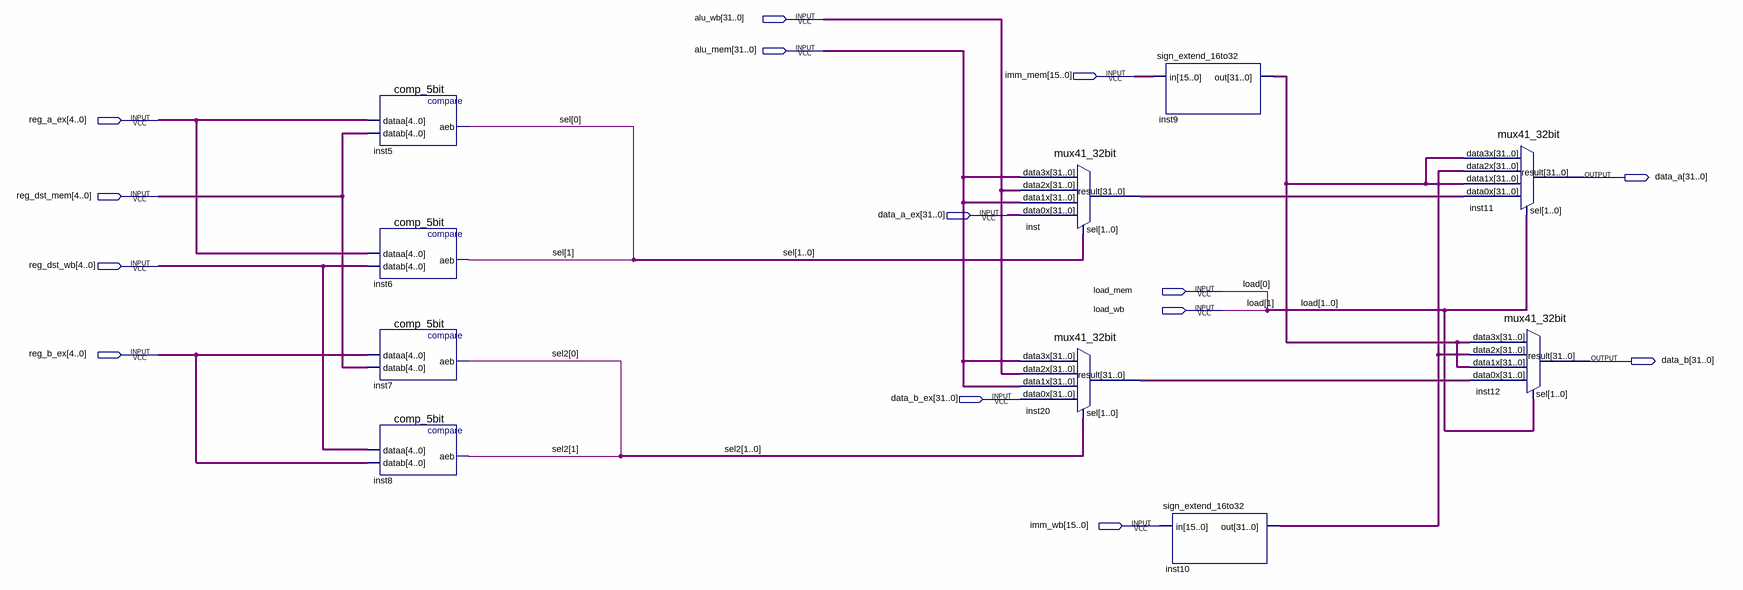
[diagram p0: schematic sheet]
// Quartus schematic reg_selector.bdf as structural Verilog: 10 symbols, 14 pins
module reg_selector (
  input  [31:0] alu_wb,
  input  [31:0] alu_mem,
  input  [15:0] imm_mem,
  input  [4:0] reg_a_ex,
  input  [4:0] reg_dst_mem,
  input  [31:0] data_a_ex,
  input  [4:0] reg_dst_wb,
  input  load_mem,
  input  load_wb,
  input  [4:0] reg_b_ex,
  input  [31:0] data_b_ex,
  input  [15:0] imm_wb,
  output [31:0] data_a,
  output [31:0] data_b
);

  wire [1:0] sel, sel2;
  wire [31:0] inst9_out, inst10_out, inst20_result, inst_result;

  comp_5bit inst5 (.dataa(reg_a_ex), .datab(reg_dst_mem), .aeb(sel[0]));
  comp_5bit inst6 (.dataa(reg_a_ex), .datab(reg_dst_wb), .aeb(sel[1]));
  comp_5bit inst7 (.dataa(reg_b_ex), .datab(reg_dst_mem), .aeb(sel2[0]));
  comp_5bit inst8 (.dataa(reg_dst_wb), .datab(reg_b_ex), .aeb(sel2[1]));
  mux41_32bit inst (
    .data3x(alu_mem), .data2x(alu_wb), .data1x(alu_mem), .data0x(data_a_ex), .sel(sel), .result(inst_result));
  mux41_32bit inst20 (
    .data3x(alu_mem), .data2x(alu_wb), .data1x(alu_mem), .data0x(data_b_ex), .sel(sel2),
    .result(inst20_result));
  sign_extend_16to32 inst9 (.in(imm_mem), .out(inst9_out));
  sign_extend_16to32 inst10 (.in(imm_wb), .out(inst10_out));
  mux41_32bit inst11 (
    .data3x(inst9_out), .data2x(inst10_out), .data1x(inst9_out), .data0x(inst_result),
    .sel({load_wb, load_mem}), .result(data_a));
  mux41_32bit inst12 (
    .data3x(inst9_out), .data2x(inst10_out), .data1x(inst9_out), .data0x(inst20_result),
    .sel({load_wb, load_mem}), .result(data_b));

  // Other names for the same wires on the sheet: load[1:0] = {load_wb, load_mem}
endmodule
